# EAGLE schematic main (EAGLE 9.5.2)

## Sheet 1 of 4
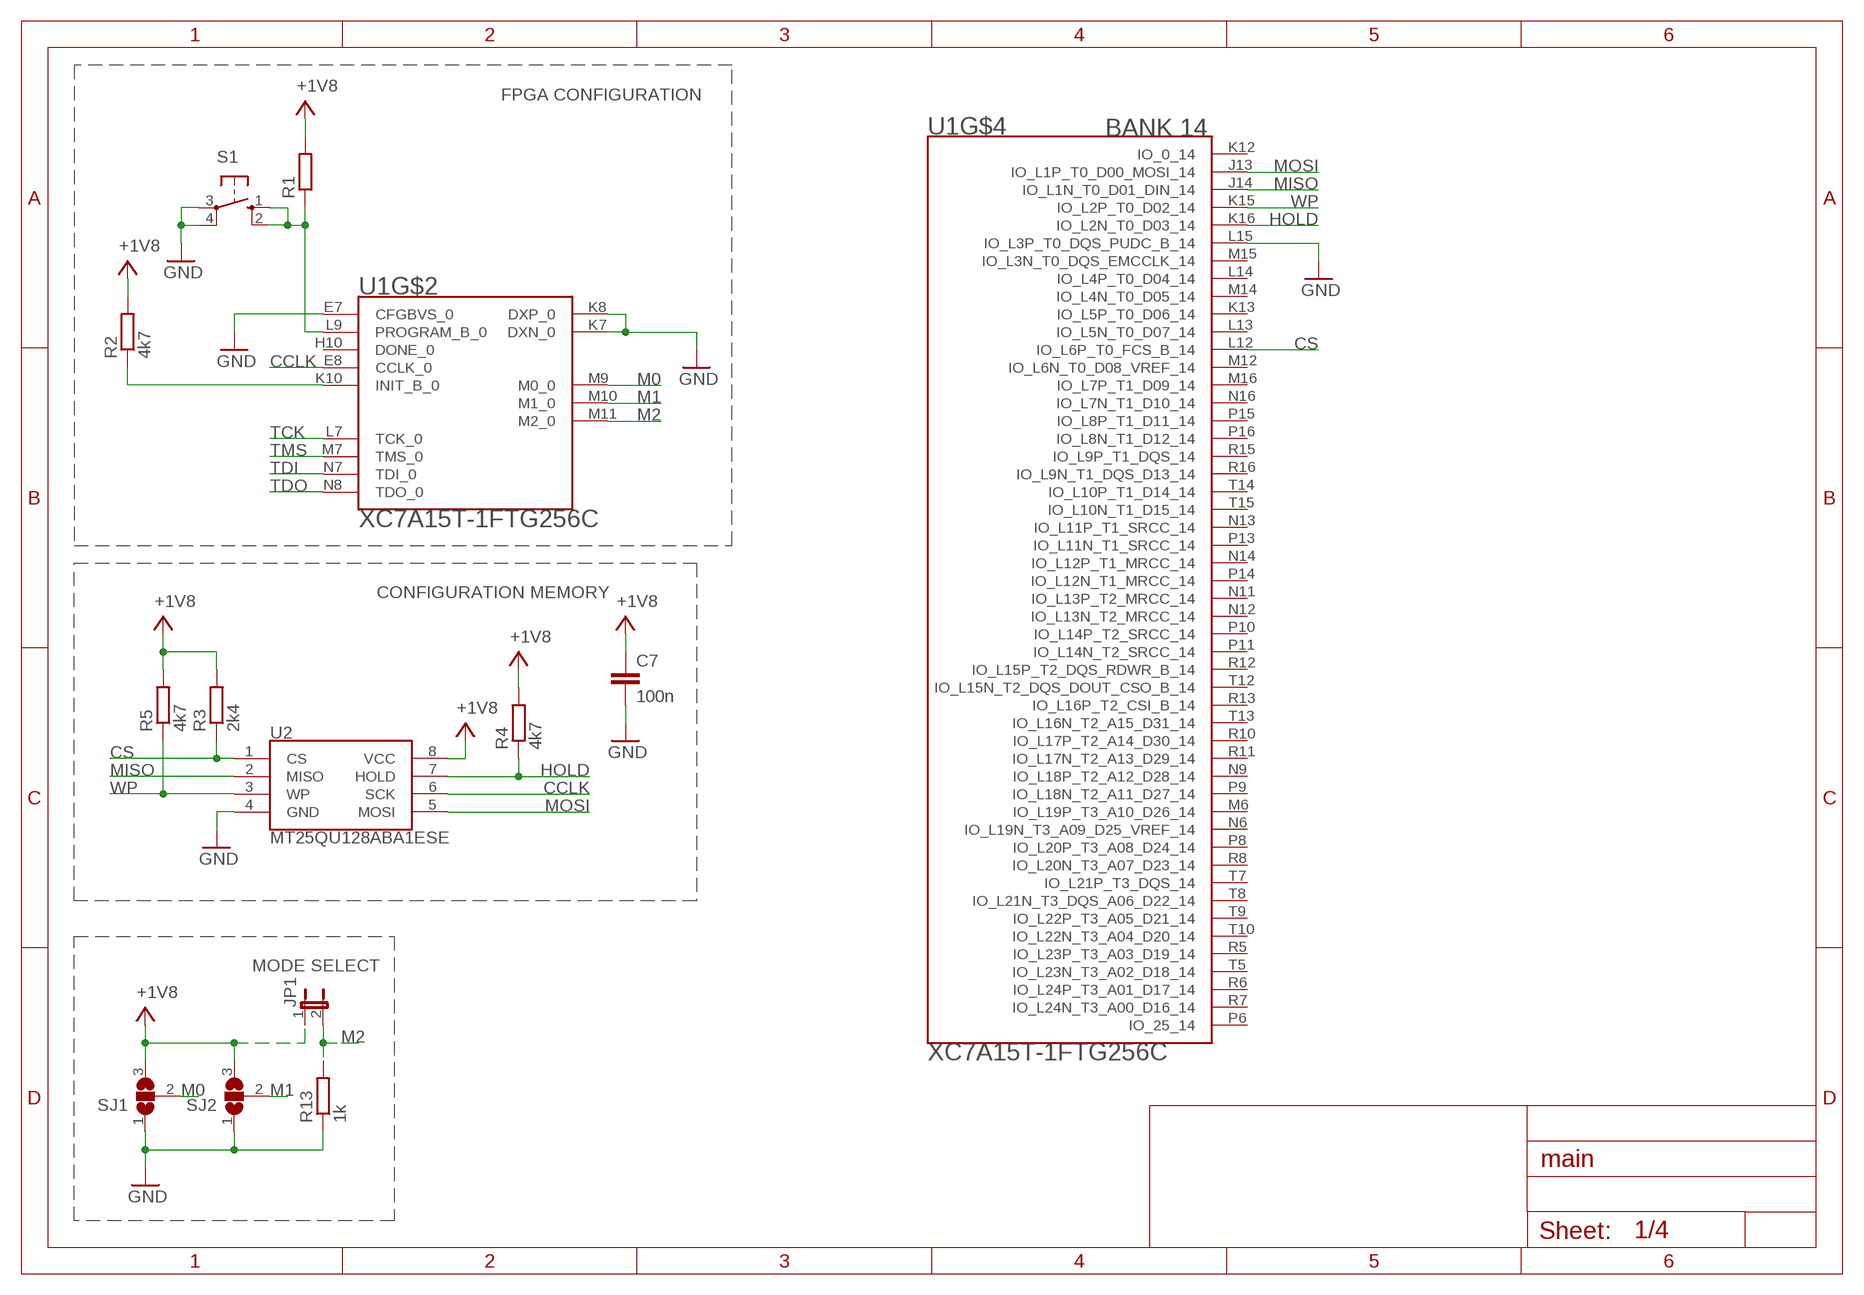
[diagram p0: schematic, sheet 1]

### Parts
C7  100n  C-EUC0603  [C0603]
JP1  JP1E  [JP1]
R1  R-EU_R0603  [R0603]
R2  4k7  R-EU_R0603  [R0603]
R3  2k4  R-EU_R0603  [R0603]
R4  4k7  R-EU_R0603  [R0603]
R5  4k7  R-EU_R0603  [R0603]
R13  1k  R-EU_R0603  [R0603]
S1  10-XX  [B3F-10XX]
SJ1  SJ2W  [SJ_2]
SJ2  SJ2W  [SJ_2]
U1  XC7A15T-1FTG256C  [BGA256C100P16X16_1700X1700X155]
U2  MT25QU128ABA1ESE  SPI_FLASH-X25XXSMD1  [SO08-EIAJ]

### Nets
+1V8: C7.1 JP1.1 R1.2 R2.2 R3.2 R4.2 R5.2 SJ1.3 SJ2.3 U2.8(VCC) ; also sheet 2
CCLK: U1.E8(CCLK_0) U2.6(SCK)
CS: R3.1 U1.L12(IO_L6P_T0_FCS_B_14) U2.1(CS)
GND: C7.2 R13.1 S1.3(P) S1.4(P1) SJ1.1 SJ2.1 U1.E7(CFGBVS_0) U1.K7(DXN_0) U1.K8(DXP_0) U1.L15(IO_L3P_T0_DQS_PUDC_B_14) U2.4(GND) ; also sheet 2,4
HOLD: R4.1 U1.K16(IO_L2N_T0_D03_14) U2.7(HOLD)
M0: SJ1.2 U1.M9(M0_0)
M1: SJ2.2 U1.M10(M1_0)
M2: JP1.2 R13.2 U1.M11(M2_0)
MISO: U1.J14(IO_L1N_T0_D01_DIN_14) U2.2(MISO)
MOSI: U1.J13(IO_L1P_T0_D00_MOSI_14) U2.5(MOSI)
N$2: R2.1 U1.K10(INIT_B_0)
N$4: R1.1 S1.1(S) S1.2(S1) U1.L9(PROGRAM_B_0)
TCK: U1.L7(TCK_0)
TDI: U1.N7(TDI_0)
TDO: U1.N8(TDO_0)
TMS: U1.M7(TMS_0)
WP: R5.1 U1.K15(IO_L2P_T0_D02_14) U2.3(WP)
Unconnected: U1.H10(DONE_0) U1.K12(IO_0_14) U1.K13(IO_L5P_T0_D06_14) U1.L13(IO_L5N_T0_D07_14) U1.L14(IO_L4P_T0_D04_14) U1.M6(IO_L19P_T3_A10_D26_14) U1.M12(IO_L6N_T0_D08_VREF_14) U1.M14(IO_L4N_T0_D05_14) U1.M15(IO_L3N_T0_DQS_EMCCLK_14) U1.M16(IO_L7P_T1_D09_14) U1.N6(IO_L19N_T3_A09_D25_VREF_14) U1.N9(IO_L18P_T2_A12_D28_14) U1.N11(IO_L13P_T2_MRCC_14) U1.N12(IO_L13N_T2_MRCC_14) U1.N13(IO_L11P_T1_SRCC_14) U1.N14(IO_L12P_T1_MRCC_14) U1.N16(IO_L7N_T1_D10_14) U1.P6(IO_25_14) U1.P8(IO_L20P_T3_A08_D24_14) U1.P9(IO_L18N_T2_A11_D27_14) U1.P10(IO_L14P_T2_SRCC_14) U1.P11(IO_L14N_T2_SRCC_14) U1.P13(IO_L11N_T1_SRCC_14) U1.P14(IO_L12N_T1_MRCC_14) U1.P15(IO_L8P_T1_D11_14) U1.P16(IO_L8N_T1_D12_14) U1.R5(IO_L23P_T3_A03_D19_14) U1.R6(IO_L24P_T3_A01_D17_14) U1.R7(IO_L24N_T3_A00_D16_14) U1.R8(IO_L20N_T3_A07_D23_14) U1.R10(IO_L17P_T2_A14_D30_14) U1.R11(IO_L17N_T2_A13_D29_14) U1.R12(IO_L15P_T2_DQS_RDWR_B_14) U1.R13(IO_L16P_T2_CSI_B_14) U1.R15(IO_L9P_T1_DQS_14) U1.R16(IO_L9N_T1_DQS_D13_14) U1.T5(IO_L23N_T3_A02_D18_14) U1.T7(IO_L21P_T3_DQS_14) U1.T8(IO_L21N_T3_DQS_A06_D22_14) U1.T9(IO_L22P_T3_A05_D21_14) U1.T10(IO_L22N_T3_A04_D20_14) U1.T12(IO_L15N_T2_DQS_DOUT_CSO_B_14) U1.T13(IO_L16N_T2_A15_D31_14) U1.T14(IO_L10P_T1_D14_14) U1.T15(IO_L10N_T1_D15_14)

### Notes on the sheet
- FPGA CONFIGURATION
- CONFIGURATION MEMORY
- MODE SELECT

## Sheet 2 of 4
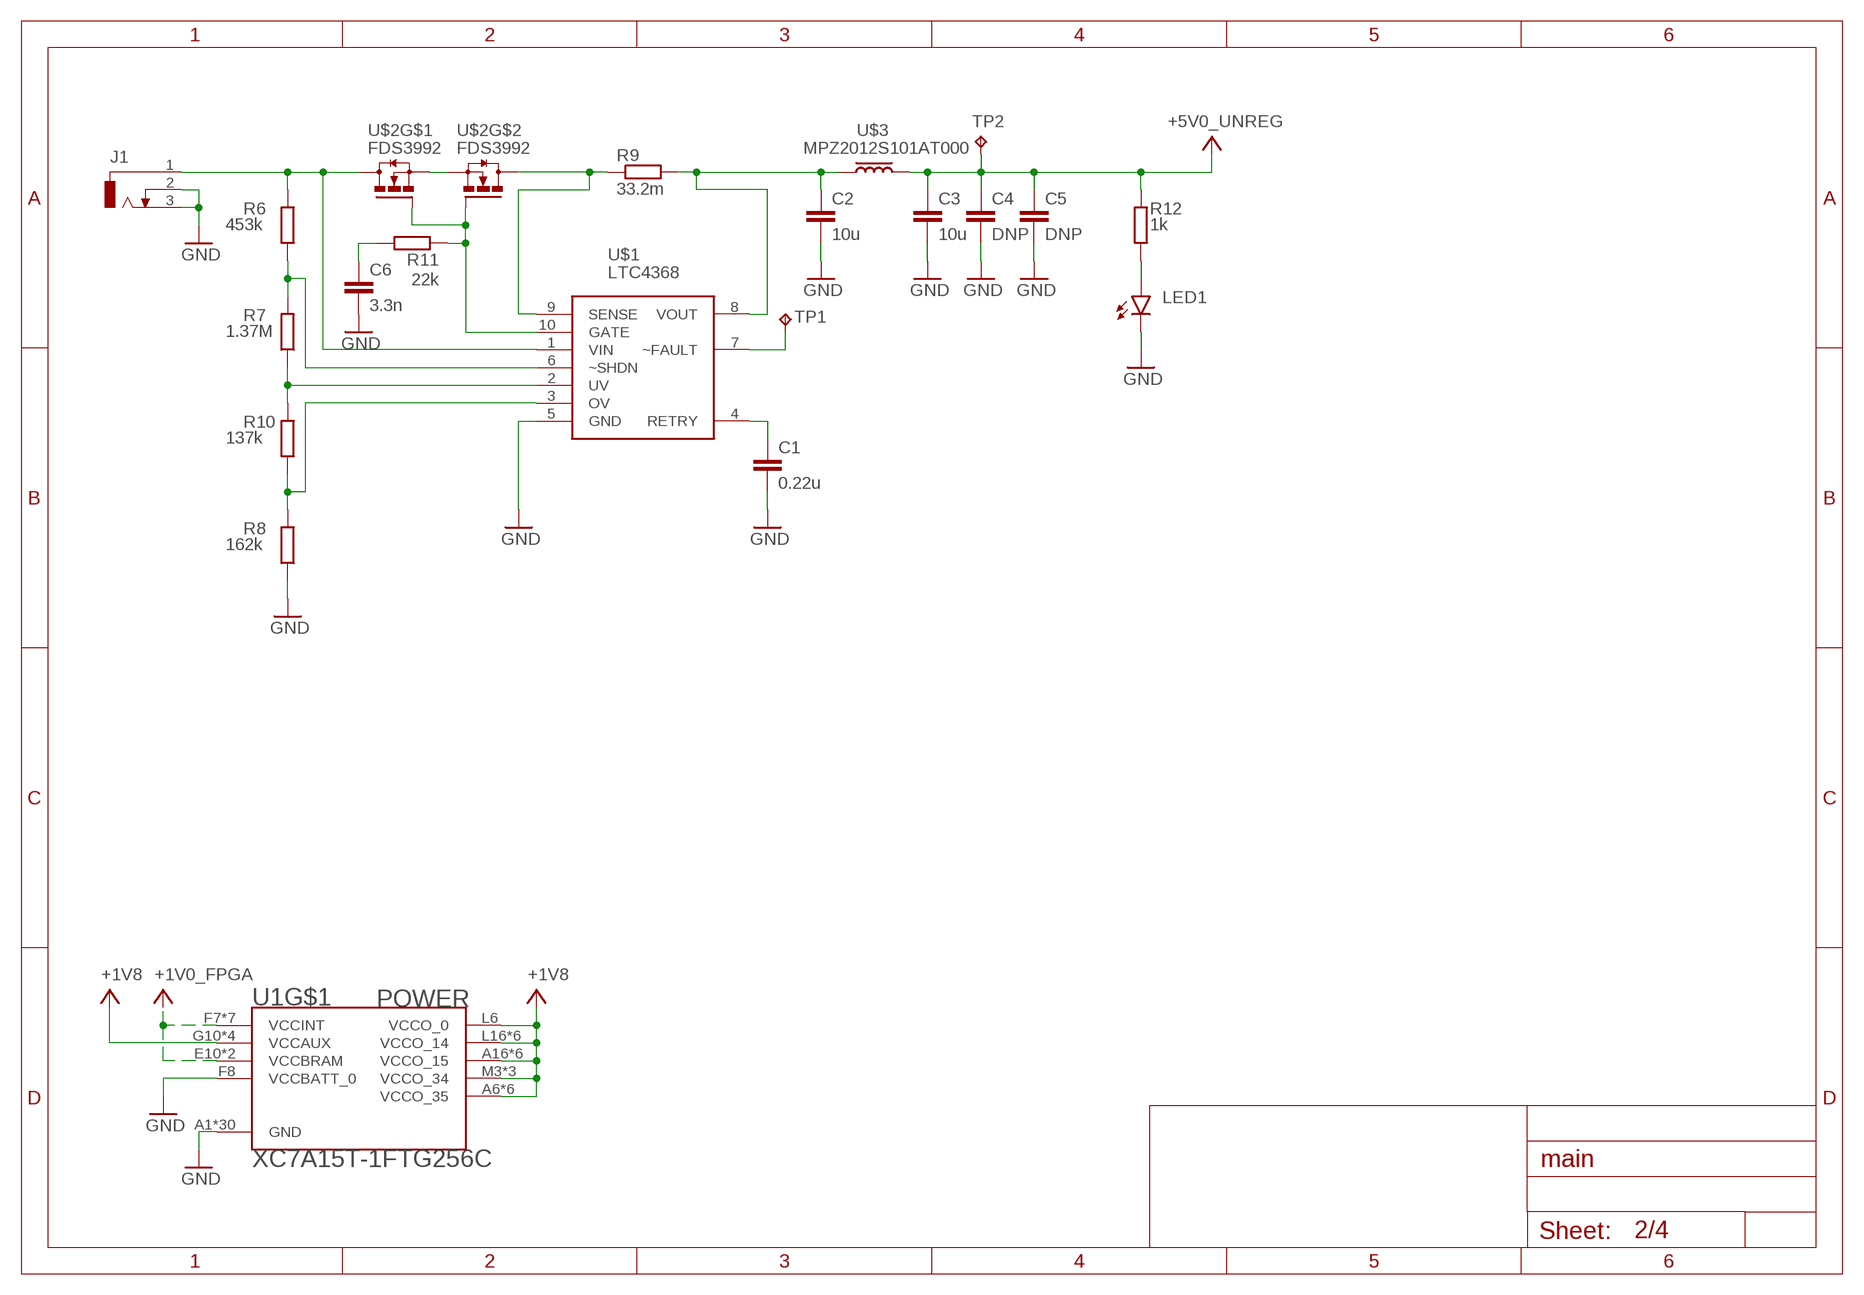
[diagram p1: schematic, sheet 2]

### Parts
C1  0.22u  C-EUC0805  [C0805]
C2  10u  C-EUC0805  [C0805]
C3  10u  C-EUC0805  [C0805]
C4  DNP  C-EUC0805  [C0805]
C5  DNP  C-EUC0805  [C0805]
C6  3.3n  C-EUC0805  [C0805]
J1  DCJ0303  [DCJ0303]
LED1  LEDCHIP-LED0805  [CHIP-LED0805]
R6  453k  R-EU_R0805  [R0805]
R7  1.37M  R-EU_R0805  [R0805]
R8  162k  R-EU_R0805  [R0805]
R9  33.2m  R-EU_R0805  [R0805]
R10  137k  R-EU_R0805  [R0805]
R11  22k  R-EU_R0805  [R0805]
R12  1k  R-EU_R0805  [R0805]
TP1  TPB1,27  [B1,27]
TP2  TPB1,27  [B1,27]
U$1  LTC4368  [MSOP10]
U$2  FDS3992  [SO-08]
U$3  MPZ2012S101AT000  [FB0805]

### Nets
+1V0_FPGA: U1.E10(VCCBRAM) U1.F7(VCCINT) U1.F9(VCCINT) U1.F11(VCCBRAM) U1.G6(VCCINT) U1.H9(VCCINT) U1.J6(VCCINT) U1.K9(VCCINT) U1.L8(VCCINT)
+1V8: U1.A6(VCCO_35) U1.A16(VCCO_15) U1.B3(VCCO_35) U1.B13(VCCO_15) U1.C10(VCCO_15) U1.D7(VCCO_35) U1.E4(VCCO_35) U1.E14(VCCO_15) U1.F1(VCCO_35) U1.G10(VCCAUX) U1.H15(VCCO_15) U1.J2(VCCO_35) U1.J10(VCCAUX) U1.J12(VCCO_15) U1.K11(VCCAUX) U1.L6(VCCO_0) U1.L10(VCCAUX) U1.L16(VCCO_14) U1.M3(VCCO_34) U1.M13(VCCO_14) U1.N10(VCCO_14) U1.P7(VCCO_14) U1.R4(VCCO_34) U1.R14(VCCO_14) U1.T1(VCCO_34) U1.T11(VCCO_14) ; also sheet 1
+5V0_UNREG: C3.1 C4.1 C5.1 R12.2 TP2.TP U$3.2
GND: C1.2 C2.2 C3.2 C4.2 C5.2 C6.2 J1.2 J1.3 LED1.C R8.1 U1.A1(GND) U1.A11(GND) U1.B8(GND) U1.C5(GND) U1.C15(GND) U1.D2(GND) U1.D12(GND) U1.E9(GND) U1.F6(GND) U1.F8(VCCBATT_0) U1.F10(GND) U1.F16(GND) U1.G3(GND) U1.G9(GND) U1.G13(GND) U1.H6(GND) U1.J9(GND) U1.J11(GND) U1.K4(GND) U1.K6(GND) U1.K14(GND) U1.L1(GND) U1.L11(GND) U1.M8(GND) U1.N5(GND) U1.N15(GND) U1.P2(GND) U1.P12(GND) U1.R9(GND) U1.T6(GND) U1.T16(GND) U$1.5(GND) ; also sheet 1,4
N$1: U$2.1(S) U$2.3(S)
N$5: C2.1 R9.2 U$1.8(VOUT) U$3.1
N$6: R11.1 U$1.10(GATE) U$2.2(G) U$2.4(G)
N$7: R7.1 R10.2 U$1.2(UV)
N$8: J1.1 R6.2 U$1.1(VIN) U$2.7(D) U$2.8(D)
N$9: R6.1 R7.2 U$1.6(~SHDN)
N$10: R8.2 R10.1 U$1.3(OV)
N$11: C1.1 U$1.4(RETRY)
N$12: R9.1 U$1.9(SENSE) U$2.5(D) U$2.6(D)
N$13: LED1.A R12.1
N$14: TP1.TP U$1.7(~FAULT)
N$15: C6.1 R11.2

## Sheet 3 of 4
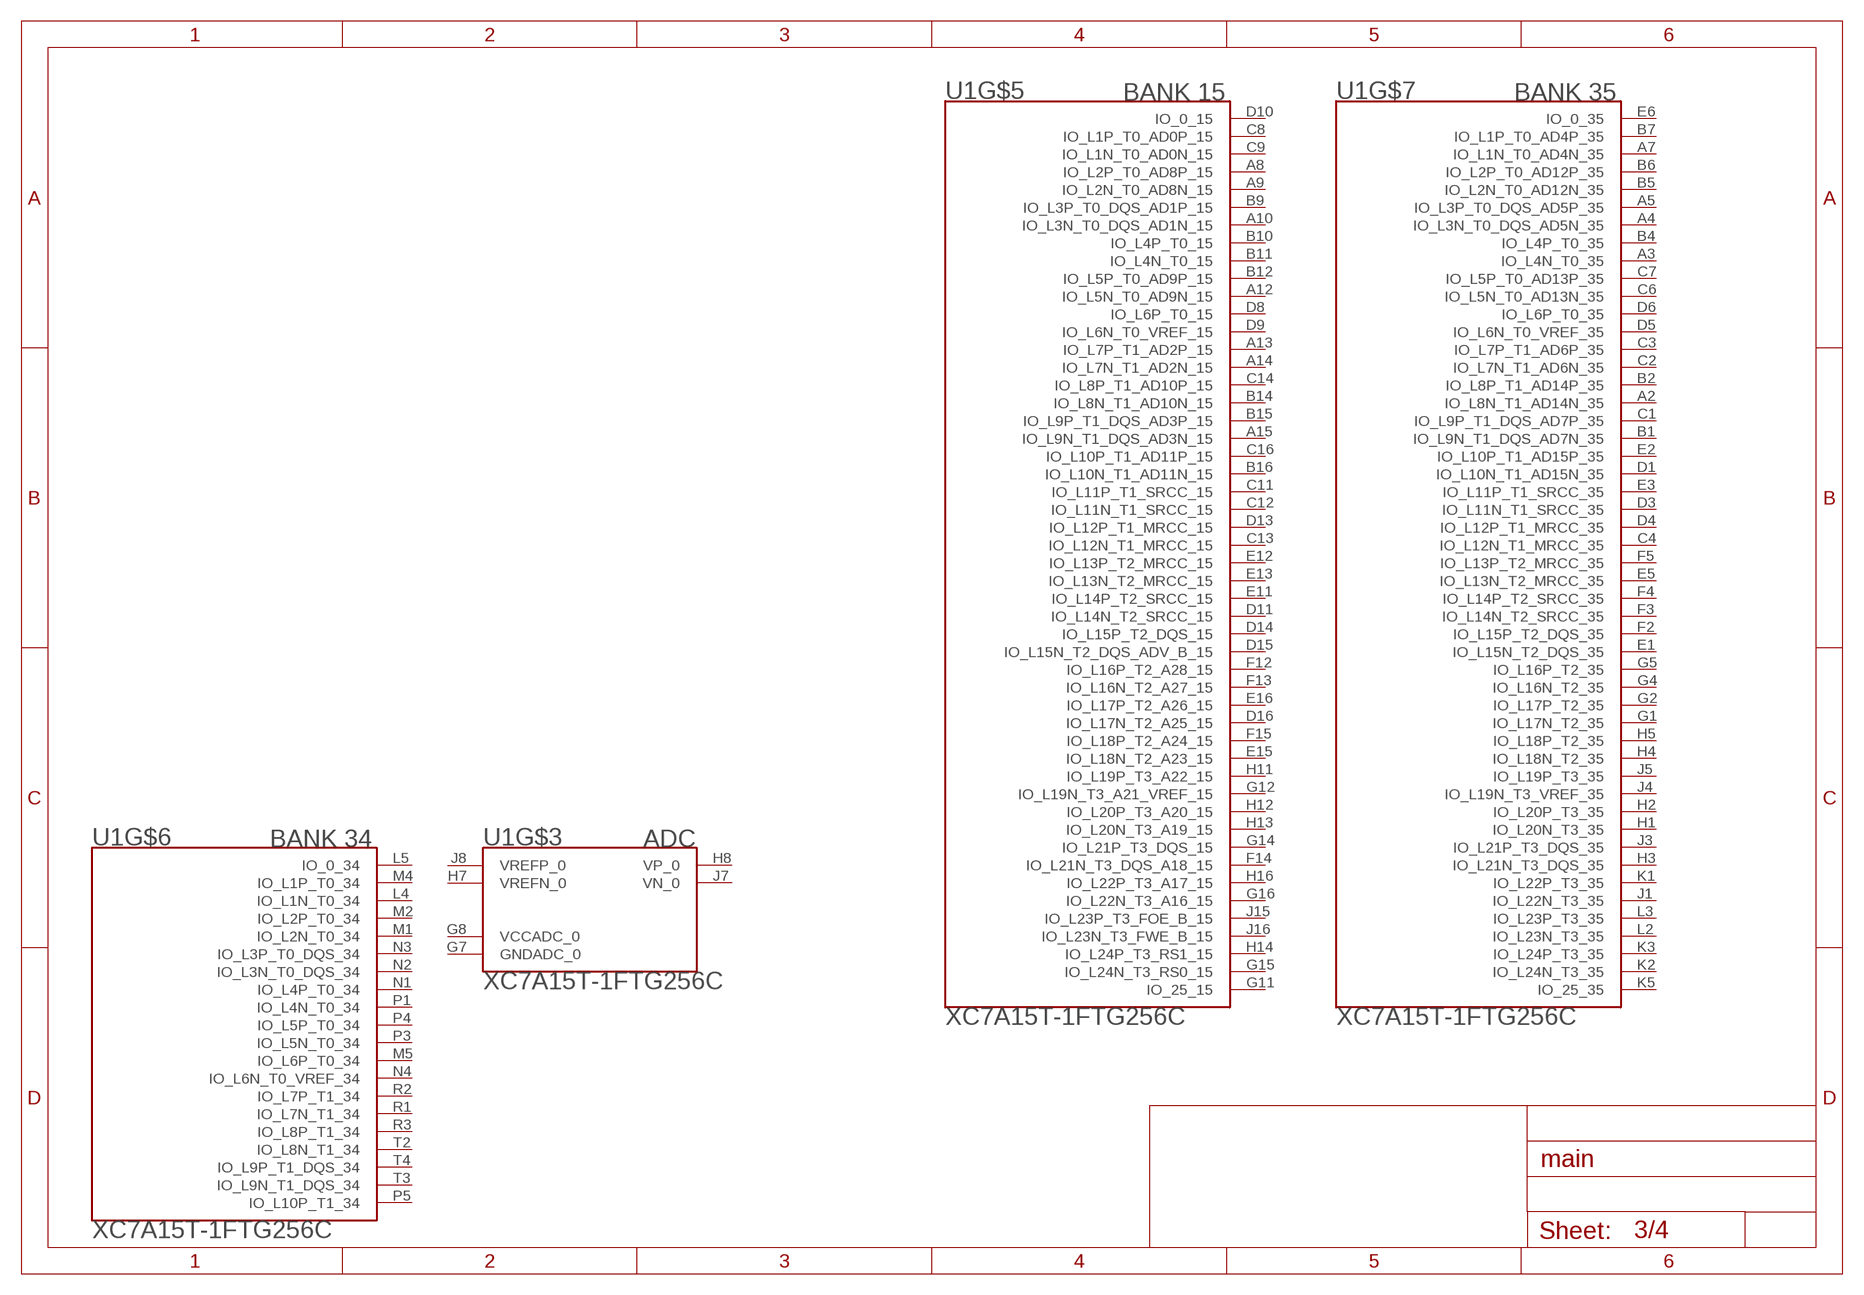
[diagram p2: schematic, sheet 3]
Unconnected: U1.A2(IO_L8N_T1_AD14N_35) U1.A3(IO_L4N_T0_35) U1.A4(IO_L3N_T0_DQS_AD5N_35) U1.A5(IO_L3P_T0_DQS_AD5P_35) U1.A7(IO_L1N_T0_AD4N_35) U1.A8(IO_L2P_T0_AD8P_15) U1.A9(IO_L2N_T0_AD8N_15) U1.A10(IO_L3N_T0_DQS_AD1N_15) U1.A12(IO_L5N_T0_AD9N_15) U1.A13(IO_L7P_T1_AD2P_15) U1.A14(IO_L7N_T1_AD2N_15) U1.A15(IO_L9N_T1_DQS_AD3N_15) U1.B1(IO_L9N_T1_DQS_AD7N_35) U1.B2(IO_L8P_T1_AD14P_35) U1.B4(IO_L4P_T0_35) U1.B5(IO_L2N_T0_AD12N_35) U1.B6(IO_L2P_T0_AD12P_35) U1.B7(IO_L1P_T0_AD4P_35) U1.B9(IO_L3P_T0_DQS_AD1P_15) U1.B10(IO_L4P_T0_15) U1.B11(IO_L4N_T0_15) U1.B12(IO_L5P_T0_AD9P_15) U1.B14(IO_L8N_T1_AD10N_15) U1.B15(IO_L9P_T1_DQS_AD3P_15) U1.B16(IO_L10N_T1_AD11N_15) U1.C1(IO_L9P_T1_DQS_AD7P_35) U1.C2(IO_L7N_T1_AD6N_35) U1.C3(IO_L7P_T1_AD6P_35) U1.C4(IO_L12N_T1_MRCC_35) U1.C6(IO_L5N_T0_AD13N_35) U1.C7(IO_L5P_T0_AD13P_35) U1.C8(IO_L1P_T0_AD0P_15) U1.C9(IO_L1N_T0_AD0N_15) U1.C11(IO_L11P_T1_SRCC_15) U1.C12(IO_L11N_T1_SRCC_15) U1.C13(IO_L12N_T1_MRCC_15) U1.C14(IO_L8P_T1_AD10P_15) U1.C16(IO_L10P_T1_AD11P_15) U1.D1(IO_L10N_T1_AD15N_35) U1.D3(IO_L11N_T1_SRCC_35) U1.D4(IO_L12P_T1_MRCC_35) U1.D5(IO_L6N_T0_VREF_35) U1.D6(IO_L6P_T0_35) U1.D8(IO_L6P_T0_15) U1.D9(IO_L6N_T0_VREF_15) U1.D10(IO_0_15) U1.D11(IO_L14N_T2_SRCC_15) U1.D13(IO_L12P_T1_MRCC_15) U1.D14(IO_L15P_T2_DQS_15) U1.D15(IO_L15N_T2_DQS_ADV_B_15) U1.D16(IO_L17N_T2_A25_15) U1.E1(IO_L15N_T2_DQS_35) U1.E2(IO_L10P_T1_AD15P_35) U1.E3(IO_L11P_T1_SRCC_35) U1.E5(IO_L13N_T2_MRCC_35) U1.E6(IO_0_35) U1.E11(IO_L14P_T2_SRCC_15) U1.E12(IO_L13P_T2_MRCC_15) U1.E13(IO_L13N_T2_MRCC_15) U1.E15(IO_L18N_T2_A23_15) U1.E16(IO_L17P_T2_A26_15) U1.F2(IO_L15P_T2_DQS_35) U1.F3(IO_L14N_T2_SRCC_35) U1.F4(IO_L14P_T2_SRCC_35) U1.F5(IO_L13P_T2_MRCC_35) U1.F12(IO_L16P_T2_A28_15) U1.F13(IO_L16N_T2_A27_15) U1.F14(IO_L21N_T3_DQS_A18_15) U1.F15(IO_L18P_T2_A24_15) U1.G1(IO_L17N_T2_35) U1.G2(IO_L17P_T2_35) U1.G4(IO_L16N_T2_35) U1.G5(IO_L16P_T2_35) U1.G11(IO_25_15) U1.G12(IO_L19N_T3_A21_VREF_15) U1.G14(IO_L21P_T3_DQS_15) U1.G15(IO_L24N_T3_RS0_15) U1.G16(IO_L22N_T3_A16_15) U1.H1(IO_L20N_T3_35) U1.H2(IO_L20P_T3_35) U1.H3(IO_L21N_T3_DQS_35) U1.H4(IO_L18N_T2_35) U1.H5(IO_L18P_T2_35) U1.H8(VP_0) U1.H11(IO_L19P_T3_A22_15) U1.H12(IO_L20P_T3_A20_15) U1.H13(IO_L20N_T3_A19_15) U1.H14(IO_L24P_T3_RS1_15) U1.H16(IO_L22P_T3_A17_15) U1.J1(IO_L22N_T3_35) U1.J3(IO_L21P_T3_DQS_35) U1.J4(IO_L19N_T3_VREF_35) U1.J5(IO_L19P_T3_35) U1.J7(VN_0) U1.J15(IO_L23P_T3_FOE_B_15) U1.J16(IO_L23N_T3_FWE_B_15) U1.K1(IO_L22P_T3_35) U1.K2(IO_L24N_T3_35) U1.K3(IO_L24P_T3_35) U1.K5(IO_25_35) U1.L2(IO_L23N_T3_35) U1.L3(IO_L23P_T3_35) U1.L4(IO_L1N_T0_34) U1.L5(IO_0_34) U1.M1(IO_L2N_T0_34) U1.M2(IO_L2P_T0_34) U1.M4(IO_L1P_T0_34) U1.M5(IO_L6P_T0_34) U1.N1(IO_L4P_T0_34) U1.N2(IO_L3N_T0_DQS_34) U1.N3(IO_L3P_T0_DQS_34) U1.N4(IO_L6N_T0_VREF_34) U1.P1(IO_L4N_T0_34) U1.P3(IO_L5N_T0_34) U1.P4(IO_L5P_T0_34) U1.P5(IO_L10P_T1_34) U1.R1(IO_L7N_T1_34) U1.R2(IO_L7P_T1_34) U1.R3(IO_L8P_T1_34) U1.T2(IO_L8N_T1_34) U1.T3(IO_L9N_T1_DQS_34) U1.T4(IO_L9P_T1_DQS_34)

## Sheet 4 of 4
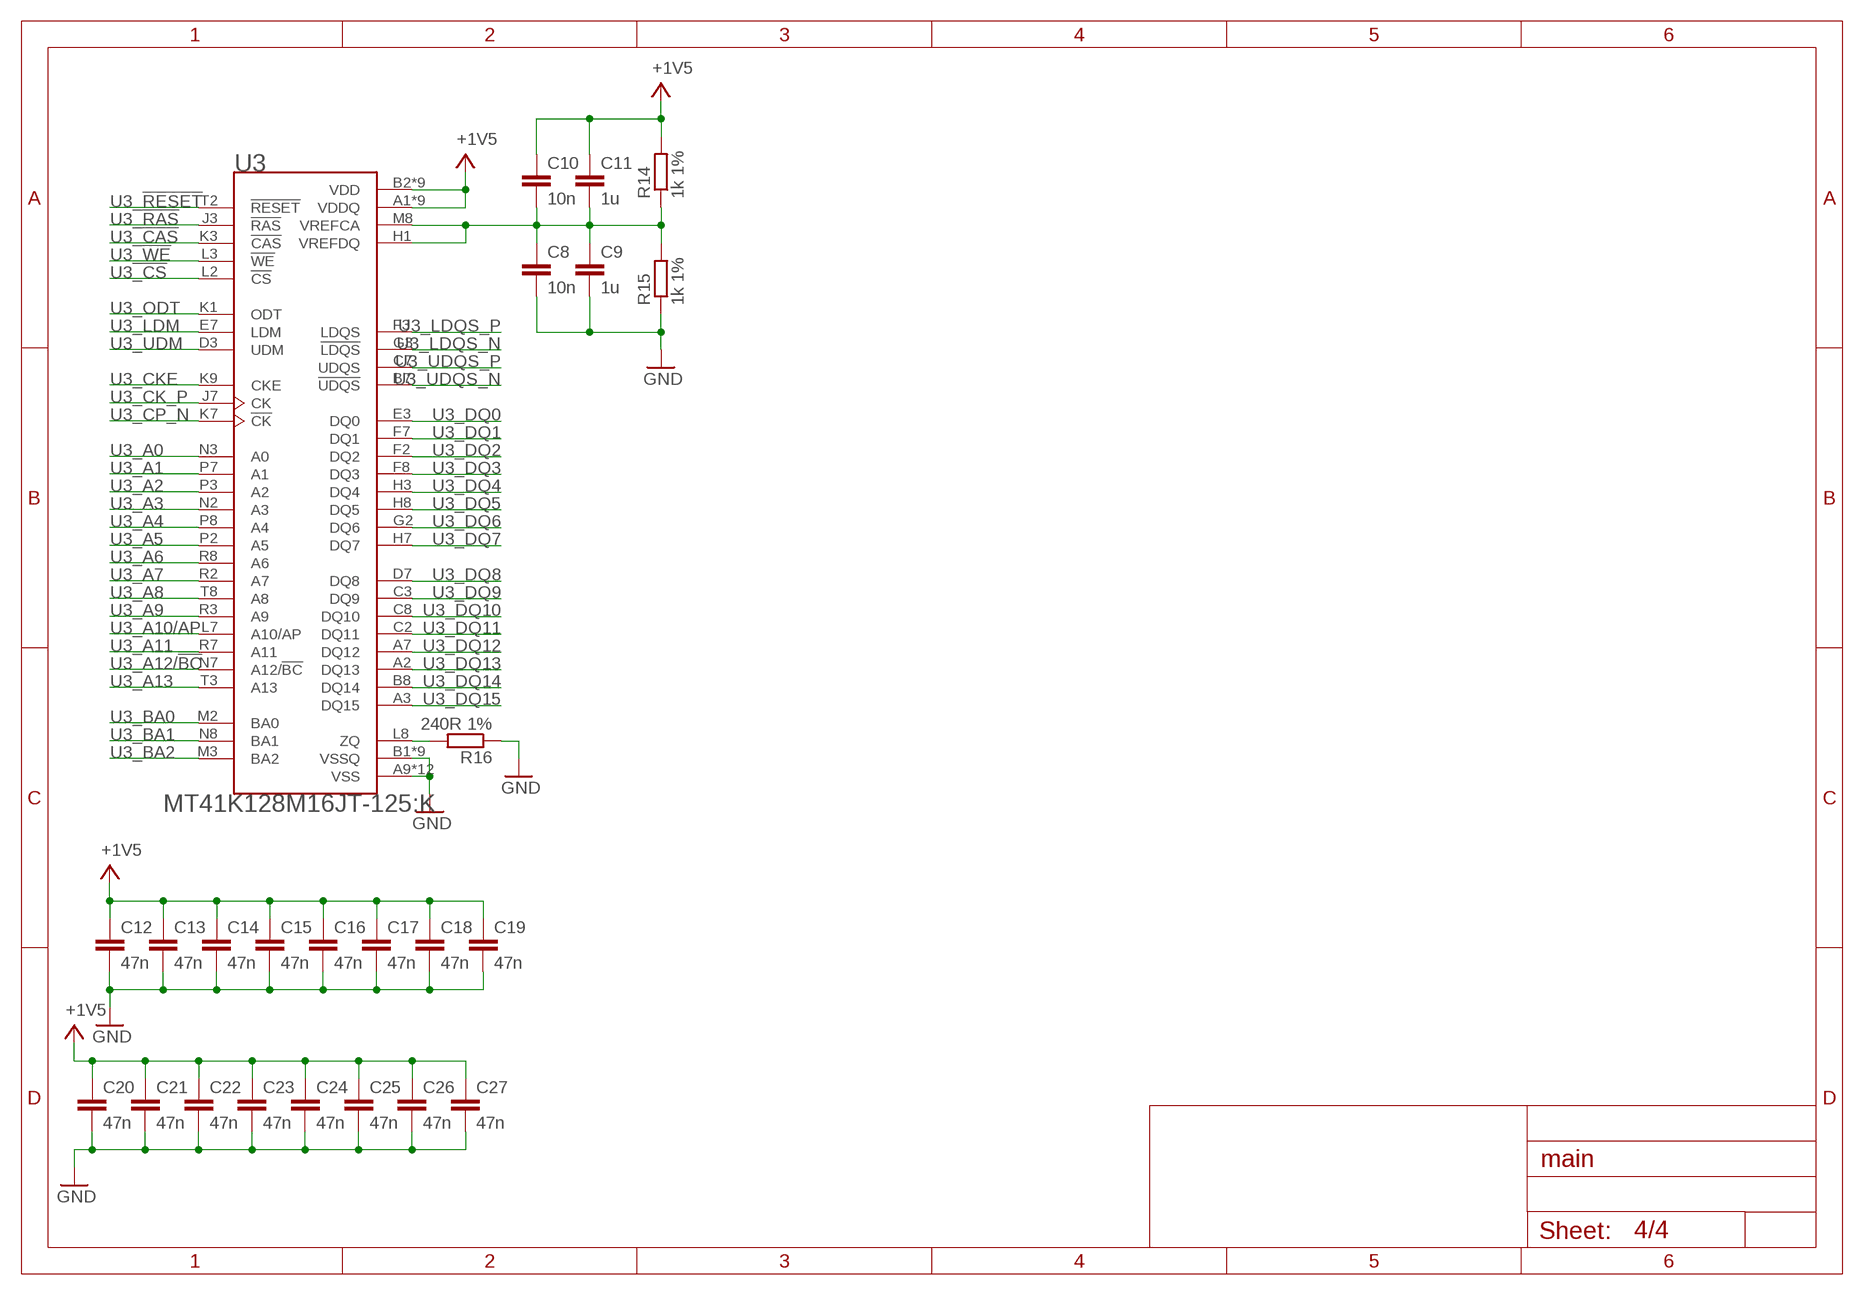
[diagram p3: schematic, sheet 4]

### Parts
C8  10n  C-EUC0603  [C0603]
C9  1u  C-EUC0603  [C0603]
C10  10n  C-EUC0603  [C0603]
C11  1u  C-EUC0603  [C0603]
C12  47n  C-EUC0603  [C0603]
C13  47n  C-EUC0603  [C0603]
C14  47n  C-EUC0603  [C0603]
C15  47n  C-EUC0603  [C0603]
C16  47n  C-EUC0603  [C0603]
C17  47n  C-EUC0603  [C0603]
C18  47n  C-EUC0603  [C0603]
C19  47n  C-EUC0603  [C0603]
C20  47n  C-EUC0603  [C0603]
C21  47n  C-EUC0603  [C0603]
C22  47n  C-EUC0603  [C0603]
C23  47n  C-EUC0603  [C0603]
C24  47n  C-EUC0603  [C0603]
C25  47n  C-EUC0603  [C0603]
C26  47n  C-EUC0603  [C0603]
C27  47n  C-EUC0603  [C0603]
R14  1k 1%  R-EU_R0603  [R0603]
R15  1k 1%  R-EU_R0603  [R0603]
R16  240R 1%  R-EU_R0603  [R0603]
U3  MT41K128M16JT-125:K  [BGA80P96C6X16_800X1400X110]

### Nets
+1V5: C10.1 C11.1 C12.1 C13.1 C14.1 C15.1 C16.1 C17.1 C18.1 C19.1 C20.1 C21.1 C22.1 C23.1 C24.1 C25.1 C26.1 C27.1 R14.2 U3.A1(VDDQ) U3.A8(VDDQ) U3.B2(VDD) U3.C1(VDDQ) U3.C9(VDDQ) U3.D2(VDDQ) U3.D9(VDD) U3.E9(VDDQ) U3.F1(VDDQ) U3.G7(VDD) U3.H2(VDDQ) U3.H9(VDDQ) U3.K2(VDD) U3.K8(VDD) U3.N1(VDD) U3.N9(VDD) U3.R1(VDD) U3.R9(VDD)
GND: C8.2 C9.2 C12.2 C13.2 C14.2 C15.2 C16.2 C17.2 C18.2 C19.2 C20.2 C21.2 C22.2 C23.2 C24.2 C25.2 C26.2 C27.2 R15.1 R16.1 U3.A9(VSS) U3.B1(VSSQ) U3.B3(VSS) U3.B9(VSSQ) U3.D1(VSSQ) U3.D8(VSSQ) U3.E1(VSS) U3.E2(VSSQ) U3.E8(VSSQ) U3.F9(VSSQ) U3.G1(VSSQ) U3.G8(VSS) U3.G9(VSSQ) U3.J2(VSS) U3.J8(VSS) U3.M1(VSS) U3.M9(VSS) U3.P1(VSS) U3.P9(VSS) U3.T1(VSS) U3.T9(VSS) ; also sheet 1,2
N$3: C8.1 C9.1 C10.2 C11.2 R14.1 R15.2 U3.H1(VREFDQ) U3.M8(VREFCA)
N$16: R16.2 U3.L8(ZQ)
U3_!CAS: U3.K3(!CAS)
U3_!CS: U3.L2(!CS)
U3_!RAS: U3.J3(!RAS)
U3_!RESET: U3.T2(!RESET)
U3_!WE: U3.L3(!WE)
U3_A0: U3.N3(A0)
U3_A1: U3.P7(A1)
U3_A2: U3.P3(A2)
U3_A3: U3.N2(A3)
U3_A4: U3.P8(A4)
U3_A5: U3.P2(A5)
U3_A6: U3.R8(A6)
U3_A7: U3.R2(A7)
U3_A8: U3.T8(A8)
U3_A9: U3.R3(A9)
U3_A10/AP: U3.L7(A10/AP)
U3_A11: U3.R7(A11)
U3_A12/!BC: U3.N7(A12/!BC)
U3_A13: U3.T3(A13)
U3_BA0: U3.M2(BA0)
U3_BA1: U3.N8(BA1)
U3_BA2: U3.M3(BA2)
U3_CK_P: U3.J7(CK)
U3_CKE: U3.K9(CKE)
U3_CP_N: U3.K7(!CK)
U3_DQ0: U3.E3(DQ0)
U3_DQ1: U3.F7(DQ1)
U3_DQ2: U3.F2(DQ2)
U3_DQ3: U3.F8(DQ3)
U3_DQ4: U3.H3(DQ4)
U3_DQ5: U3.H8(DQ5)
U3_DQ6: U3.G2(DQ6)
U3_DQ7: U3.H7(DQ7)
U3_DQ8: U3.D7(DQ8)
U3_DQ9: U3.C3(DQ9)
U3_DQ10: U3.C8(DQ10)
U3_DQ11: U3.C2(DQ11)
U3_DQ12: U3.A7(DQ12)
U3_DQ13: U3.A2(DQ13)
U3_DQ14: U3.B8(DQ14)
U3_DQ15: U3.A3(DQ15)
U3_LDM: U3.E7(LDM)
U3_LDQS_N: U3.G3(!LDQS)
U3_LDQS_P: U3.F3(LDQS)
U3_ODT: U3.K1(ODT)
U3_UDM: U3.D3(UDM)
U3_UDQS_N: U3.B7(!UDQS)
U3_UDQS_P: U3.C7(UDQS)

## Power pins joined to a net without a drawn wire
GNDADC_0: U1.G7(GNDADC_0)
VCCADC_0: U1.G8(VCCADC_0)
VREFN_0: U1.H7(VREFN_0)
VREFP_0: U1.J8(VREFP_0)

## Library data of the parts
C1-C27 = rcl:C-EU: CAPACITOR, European symbol; SPICEPREFIX: C
J1 = con-jack:DCJ0303: DC POWER JACK Source: DCJ0303.pdf; OC_FARNELL: unknown; OC_NEWARK: unknown
JP1 = jumper:JP1E: JUMPER
LED1 = led:LED: LED OSRAM: - CHIPLED LG R971, LG N971, LY N971, LG Q971, LY Q971, LO R971, LY R971 LH N974, LH R974 LS Q976, LO Q976, LY Q976 LO Q996 - Hyper CHIPLED LW Q18S LB Q993, LB Q99A, LB R99A - SideLED LS A670, LO A670, LY A670, LG A670, LP A670 LB A673, LV A673, LT A673, LW A673 LH A674 LY A675 LS A676, LA A676, LO A676, LY A676, LW A676 LS A679, LY A679, LG A679 - Hyper Micro SIDELED® LS Y876, LA Y876, LO Y876, LY Y876 LT Y87S - SmartLED LW L88C, LW L88S LB L89C, LB L89S, LG L890 LS L89K, LO L89K, LY L89K LS L896, LA L896, LO L896, LY L896 - TOPLED LS T670, LO T670, LY T670, LG T670, LP T670 LSG T670, LSP T670, LSY T670, LOP T670, LYG T670 LG T671, LOG T671, LSG T671 LB T673, LV T673, LT T673, LW T673 LH T674 LS T676, LA T676, LO T676, LY T676, LB T676, LH T676, LSB T676, LW T676 LB T67C, LV T67C, LT T67C, LS T67K, LO T67K, LY T67K, LW E67C LS E67B, LA E67B, LO E67B, LY E67B, LB E67C, LV E67C, LT E67C LW T67C LS T679, LY T679, LG T679 LS T770, LO T770, LY T770, LG T770, LP T770 LB T773, LV T773, LT T773, LW T773 LH T774 LS E675, LA E675, LY E675, LS T675 LS T776, LA T776, LO T776, LY T776, LB T776 LHGB T686 LT T68C, LB T68C - Hyper Mini TOPLED® LB M676 - Mini TOPLED Santana® LG M470 LS M47K, LO M47K, LY M47K Source: http://www.osram.convergy.de LUXEON: - LUMILED® LXK2-PW12-R00, LXK2-PW12-S00, LXK2-PW14-U00, LXK2-PW14-V00 LXK2-PM12-R00, LXK2-PM12-S00, LXK2-PM14-U00 LXK2-PE12-Q00, LXK2-PE12-R00, LXK2-PE12-S00, LXK2-PE14-T00, LXK2-PE14-U00 LXK2-PB12-K00, LXK2-PB12-L00, LXK2-PB12-M00, LXK2-PB14-N00, LXK2-PB14-P00, LXK2-PB14-Q00 LXK2-PR12-L00, LXK2-PR12-M00, LXK2-PR14-Q00, LXK2-PR14-R00 LXK2-PD12-Q00, LXK2-PD12-R00, LXK2-PD12-S00 LXK2-PH12-R00, LXK2-PH12-S00 LXK2-PL12-P00, LXK2-PL12-Q00, LXK2-PL12-R00 Source: www.luxeon.com KINGBRIGHT: KA-3528ASYC Source: www.kingbright.com
R1-R16 = rcl:R-EU_: RESISTOR, European symbol; SPICEPREFIX: R
S1 = switch-omron:10-XX: OMRON SWITCH; MPN: B3F-1000; OC_FARNELL: 176432; OC_NEWARK: 36M3542
SJ1 SJ2 = jumper:SJ2W: SMD solder JUMPER
TP1 TP2 = testpad:TP: Test pad
U1 = XC7A35T-1FTG256C:XC7A15T-1FTG256C: FPGA Artix-7 Family 33280 Cells 28nm Technology 1V 256-Pin FBGA; AVAILABILITY: Available; DESCRIPTION: FPGA Artix-7 Family 33280 Cells 28nm Technology 1V 256-Pin FBGA; MF: Xilinx Inc.; MP: XC7A15T-1FTG256C; PACKAGE: LBGA-256 Xilinx; PRICE: None
U2 = SparkFun-IC-Memory:SPI_FLASH-X25XX: 32M Serial Flash Memory 8pin SPI Flash series x25xx. Works with devices like W25X32 and BR25L32 Datasheet <http://www.macronix.com/Lists/Datasheet/Attachments/5031/MX25L3206E,%203V,%2032Mb,%20v1.5.pdf> SparkFun Products SparkFun Venus GPS Logger <https://www.sparkfun.com/products/10920> (GPS-10920); PROD_ID: IC-09109; VALUE: 25F32006WSOI
U3 = MT41K128M16JT-125_K:MT41K128M16JT-125:K: DRAM Chip DDR3L SDRAM 2G-Bit 128Mx16 1.35V 96-Pin FBGA; AVAILABILITY: Unavailable; DESCRIPTION: SDRAM - DDR3L Memory IC 2Gb _128M x 16_ Parallel 800MHz 13.75ns 96-FBGA _8x14_; MF: Micron Technology; MP: MT41K128M16JT-125:K; PACKAGE: TFBGA-96 Micron; PRICE: None
U$1 = LTC4368:LTC4368
U$2 = FDS3992:FDS3992
U$3 = MPZ2012S101AT000:MPZ2012S101AT000